# Altium project cat.PrjPcb (part 3 of 6)

## Sheet user_interface.SchDoc: User Interface
size A4; SheetNumber: 3; SheetTotal: 6
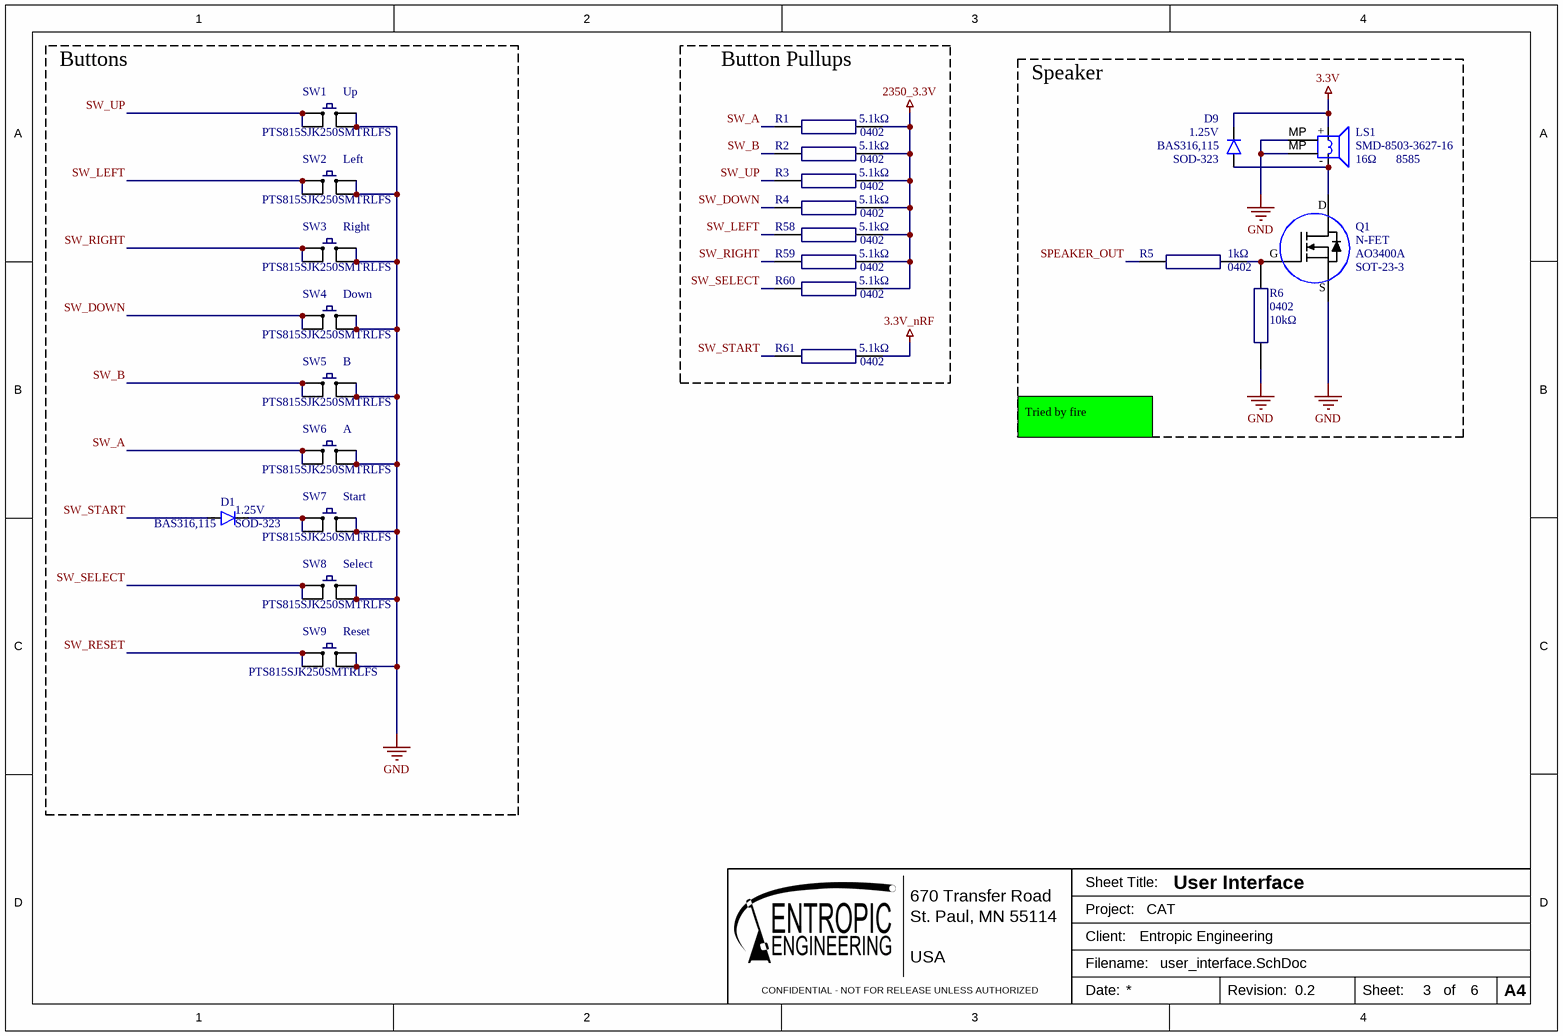
[diagram p2: user_interface.SchDoc]

### Parts
D1  Forward Voltage: 1.25V  [SOD-323]  (hidden comment: BAS316,115)
D9  Forward Voltage: 1.25V  [SOD-323]  (hidden comment: BAS316,115)
LS1  Resistance: 16Ω  package: 8585  [8585_speaker]  (hidden comment: SMD-8503-3627-16)
Q1  N-FET  Case/Package: SOT-23-3  [SOT95P280X115-3N]
R1  value 5.1kΩ  Case/Package: 0402  [0402_resistor]  (hidden comment: RC0402FR-075K1L)
R2  value 5.1kΩ  Case/Package: 0402  [0402_resistor]  (hidden comment: RC0402FR-075K1L)
R3  value 5.1kΩ  Case/Package: 0402  [0402_resistor]  (hidden comment: RC0402FR-075K1L)
R4  value 5.1kΩ  Case/Package: 0402  [0402_resistor]  (hidden comment: RC0402FR-075K1L)
R5  value 1kΩ  Case/Package: 0402  [0402_resistor]  (hidden comment: RC0402JR-071KL)
R6  value 10kΩ  Case Code (Imperial): 0402  [0402_resistor]  (hidden comment: RC0402FR-0710KL)
R58  value 5.1kΩ  Case/Package: 0402  [0402_resistor]  (hidden comment: RC0402FR-075K1L)
R59  value 5.1kΩ  Case/Package: 0402  [0402_resistor]  (hidden comment: RC0402FR-075K1L)
R60  value 5.1kΩ  Case/Package: 0402  [0402_resistor]  (hidden comment: RC0402FR-075K1L)
R61  value 5.1kΩ  Case/Package: 0402  [0402_resistor]  (hidden comment: RC0402FR-075K1L)
SW1  Up  [PTS815]
SW2  Left  [PTS815]
SW3  Right  [PTS815]
SW4  Down  [PTS815]
SW5  B  [PTS815]
SW6  A  [PTS815]
SW7  Start  [PTS815]
SW8  Select  [PTS815]
SW9  Reset  [PTS815]

### Blocks framed on the sheet
Buttons: D1 SW1-SW9
Button Pullups: R1-R4 R58-R61
Speaker: D9 LS1 Q1 R5 R6

### Nets
3.3V: D9.K LS1.+
3.3V_nRF: R61.1
2350_3.3V: R1.1 R2.1 R3.1 R4.1 R58.1 R59.1 R60.1
GND: LS1.MP Q1.2(S) R6.2 SW1.3 SW1.4 SW2.3 SW2.4 SW3.3 SW3.4 SW4.3 SW4.4 SW5.3 SW5.4 SW6.3 SW6.4 SW7.3 SW7.4 SW8.3 SW8.4 SW9.1 SW9.2
SPEAKER_OUT: R5.1
SW_A: R1.2 SW6.1 SW6.2
SW_B: R2.2 SW5.1 SW5.2
SW_DOWN: R4.2 SW4.1 SW4.2
SW_LEFT: R58.2 SW2.1 SW2.2
SW_RESET: SW9.3 SW9.4
SW_RIGHT: R59.2 SW3.1 SW3.2
SW_SELECT: R60.2 SW8.1 SW8.2
SW_START: D1.A R61.2
SW_UP: R3.2 SW1.1 SW1.2
NetD1_K: D1.K SW7.1 SW7.2
NetD9_A: D9.A LS1.- Q1.3(D)
NetQ1_1: Q1.1(G) R5.2 R6.1

### Notes on the sheet
- Tried by fire
- 670 Transfer Road
- St. Paul, MN 55114
- Sheet Title:
- Project:
- CONFIDENTIAL - NOT FOR RELEASE UNLESS AUTHORIZED
- USA
- Client:
- Filename:
- Date:
- Revision:
- Sheet:
- of
- A4

### Library data of the parts
D1 D9 = BAS316,115: 1.25 V, 100 V max, 150 mA, 4 ns diode, SOD-323; Manufacturer: Nexperia; Diode Element Material: SILICON; Package Body Material: Plastic; Diode Type: RECTIFIER; Non-rep Pk Forward Current-Max: 4A; Number of Elements: 1; Max Output current: 250mA; Max Power Dissipation: 400mW; Rep Pk Reverse Voltage-Max: 85V; Max Reverse Current: 1uA; Reverse Recovery Time-Max: 0.004us; Time @ Peak Reflow Temperature-Max (s): 40s; Reference Standard: AEC-Q101; Qualification Status: Not Qualified; Supplier 1: LCSC; Manufacturer Part Number: BAS316,115; RoHS: Yes; Category: Rectifier Diodes; Stock 1: 292660; Pricing 1: 50=0.0098, 500=0.0076, 3000=0.0067, 6000=0.0058, 24000=0.0055, 51000=0.0053 (USD); Pins: 2; Package Shape: Rectangular; Terminal Finish: Tin; Max Operating Temperature: 150°C; JESD-609 Code: e3; JESD-30 Code: R-PDSO-G2; Moisture Sensitivity Level: 1; Package Style: SMALL OUTLINEMeter; Peak Reflow Temperature (Cel): 260°C; Surface Mount: Yes; Terminal Form: Gull Wing; Terminal Position: DUAL; Reach SVHC Compliant: Yes; RoHS Compliant: Yes; ComponentLink1URL: https://datasheet.ciiva.com:443/pdfs/VipMasterIC/IC/PHGL/PHGL-S-A0000133609/PHGL-S-A0000133609-1.pdf?src-supplier=IHS+Markit; ComponentLink1Description: https://datasheet.ciiva.com:443/pdfs/VipMasterIC/IC/PHGL/PHGL-S-A0000133609/PHGL-S-A0000133609-1.pdf?src-supplier=IHS+Markit; ComponentLink2URL: http://www.farnell.com/datasheets/1856332.pdf?src-supplier=Farnell; ComponentLink2Description: http://www.farnell.com/datasheets/1856332.pdf?src-supplier=Farnell; ComponentLink3URL: https://datasheet.octopart.com/BAS316%2C115-Nexperia-datasheet-32749520.pdf?src-supplier=Element14; ComponentLink3Description: https://datasheet.octopart.com/BAS316%2C115-Nexperia-datasheet-32749520.pdf?src-supplier=Element14; ComponentLink4URL: https://datasheet.octopart.com/BAS316%2C115-Nexperia-datasheet-77871323.pdf?src-supplier=Future+Electronics; ComponentLink4Description: https://datasheet.octopart.com/BAS316%2C115-Nexperia-datasheet-77871323.pdf?src-supplier=Future+Electronics; ComponentLink5URL: https://assets.nexperia.com/documents/data-sheet/BAS16_SER.pdf?src-supplier=Digikey; ComponentLink5Description: https://assets.nexperia.com/documents/data-sheet/BAS16_SER.pdf?src-supplier=Digikey; ComponentLink6URL: http://www.farnell.com/datasheets/1856332.pdf?src-supplier=Newark; ComponentLink6Description: http://www.farnell.com/datasheets/1856332.pdf?src-supplier=Newark; ComponentLink7URL: https://datasheet.octopart.com/BAS316%2C115-NXP-datasheet-5319124.pdf?src-supplier=TME; ComponentLink7Description: https://datasheet.octopart.com/BAS316%2C115-NXP-datasheet-5319124.pdf?src-supplier=TME; Supplier Part Number 1: C109218; Package: SOD-323
LS1 = SMD-8503-3627-16: 16 Ω, 8.5 mm x 8.5 mm, SMD speaker; Manufacturer: S&S; Supplier 1: LCSC; RoHS: No; Category: Uncategorized; Stock 1: 6390; Pricing 1: 5=0.2676, 50=0.2148, 150=0.1922, 1000=0.1559, 2000=0.1433, 5000=0.1358 (USD); Supplier Part Number 1: C2685545; Manufacturer Part Number: SMD-8503-3627-16; house_part_number: SMD-8503-3627-16
Q1 = AO3400A: N-FET, 30V, 5.7A, SOT-23-3; Manufacturer: Alpha & Omega Semiconductor; Rds On Max: 26.5mR; Input Capacitance: 630pF; Max Power Dissipation: 1.4W; Drain to Source Resistance: 18mR; Number of Channels: 1NUMBER; Threshold Voltage: 650mV; Turn-Off Delay Time: 25ns; Turn-On Delay Time: 3ns; Supplier: Arrow Electronics; RoHS: Yes; Category: MOSFETs; Stock: 141000; Pricing: 3000=0.0899, 6000=0.0869, 9000=0.0763, 30000=0.0746, 75000=0.0627 (USD); Mounting Technology: Surface Mount; Min Operating Temperature: -55°C; Max Operating Temperature: 150°C; Packaging: Cut Tape; Drain to Source Voltage (Vdss): 30V; Continuous Drain Current (ID): 5.7A; Series: -; Drain to Source Breakdown Voltage: 30V; Height: 1.25mm; Lead Free: Lead Free; RoHS Compliant: Yes; ComponentLink1URL: https://datasheet.ciiva.com/940/ao3400a-940739.pdf?src-supplier=Digikey; ComponentLink1Description: https://datasheet.ciiva.com/940/ao3400a-940739.pdf?src-supplier=Digikey; ComponentLink2URL: https://datasheet.ciiva.com/26906/getdatasheetpartid-64438-26906526.pdf?src-supplier=Verical; ComponentLink2Description: https://datasheet.ciiva.com/26906/getdatasheetpartid-64438-26906526.pdf?src-supplier=Verical; ComponentLink3URL: https://datasheet.ciiva.com/940/ao3400a-940740.pdf?src-supplier=Digikey; ComponentLink3Description: https://datasheet.ciiva.com/940/ao3400a-940740.pdf?src-supplier=Digikey; ComponentLink4URL: https://datasheet.ciiva.com/940/ao3400a-940741.pdf?src-supplier=Digikey; ComponentLink4Description: https://datasheet.ciiva.com/940/ao3400a-940741.pdf?src-supplier=Digikey; Manufacturer Part Number: AO3400A; house_part_number: AO3400A; Supplier Part Number 1: AO3400A
R1-R4 R58-R61 = RC0402FR-075K1L: 5.1 kΩ, 0402 Chip resistor; Manufacturer: Yageo; house_part_number: R-5.1k-0402-1%-001; Power Rating: 63mW; Tolerance: 1%; Temperature Coefficient: 100ppm/°C; Voltage Rating: 50V; Manufacturer Part Number: RC0402FR-075K1L; RoHS: Yes; Category: Chip SMD Resistors; Stock: 1190000; Pricing: 10000=0.0024, 50000=0.0023, 250000=0.0021, 500000=0.0021, 1500000=0.0019 (USD); Case Code (Metric): 1005; Case Code (Imperial): 0402; Min Operating Temperature: -55°C; Max Operating Temperature: 155°C; Technology: THICK FILM; Packaging: Tape and Reel; Package Quantity: 1; Resistor Type: Thick Film; Number of Terminations: 2; Termination: SMD/SMT; Max Power Dissipation: 63mW; Working Voltage: 50V; Features: Moisture Resistant; Series: RC; Resistance Tolerance: 1%; Construction: Rectangular; Voltage Rating (DC): 50V; Length: 1mm; Width: 0.02inch; Height: 0.016inch; Depth: 0.5mm; RoHS Compliant: Yes; Military Standard: Not; Reach SVHC Compliant: Unknown; Lead Free: 5697LeadFree; ComponentLink1URL: https://datasheet.ciiva.com/7983/1018594-7983519.pdf?src-supplier=Element14; ComponentLink1Description: https://datasheet.ciiva.com/7983/1018594-7983519.pdf?src-supplier=Element14; ComponentLink2URL: https://datasheet.ciiva.com/46394/1018594-46394936.pdf?src-supplier=Element14; ComponentLink2Description: https://datasheet.ciiva.com/46394/1018594-46394936.pdf?src-supplier=Element14; ComponentLink3URL: https://datasheet.ciiva.com/2453/pyu-r-int-thick-7-2453401.pdf?src-supplier=Digikey; ComponentLink3Description: https://datasheet.ciiva.com/2453/pyu-r-int-thick-7-2453401.pdf?src-supplier=Digikey; ComponentLink4URL: https://datasheet.ciiva.com/2453/pyu-r-int-thick-7-2453402.pdf?src-supplier=Digikey; ComponentLink4Description: https://datasheet.ciiva.com/2453/pyu-r-int-thick-7-2453402.pdf?src-supplier=Digikey; ComponentLink5URL: https://datasheet.ciiva.com/2453/pyu-r-int-thick-7-2453400.pdf?src-supplier=Digikey; ComponentLink5Description: https://datasheet.ciiva.com/2453/pyu-r-int-thick-7-2453400.pdf?src-supplier=Digikey; ComponentLink6URL: https://datasheet.ciiva.com/12558/pyu-rc0402-51-rohs-l-6-r-8721-12558460.pdf?src-supplier=Mouser; ComponentLink6Description: https://datasheet.ciiva.com/12558/pyu-rc0402-51-rohs-l-6-r-8721-12558460.pdf?src-supplier=Mouser; ComponentLink7URL: https://datasheet.ciiva.com/16744/pyu-rc0402-51-rohs-l-6-r-16744283.pdf?src-supplier=Future+Electronics; ComponentLink7Description: https://datasheet.ciiva.com/16744/pyu-rc0402-51-rohs-l-6-r-16744283.pdf?src-supplier=Future+Electronics; ComponentLink8URL: https://datasheet.ciiva.com/15189/getdatasheetpartid-323636-15189493.pdf?src-supplier=Verical; ComponentLink8Description: https://datasheet.ciiva.com/15189/getdatasheetpartid-323636-15189493.pdf?src-supplier=Verical; Supplier 1: Future Electronics; Supplier Part Number 1: 6053649
R5 = RC0402JR-071KL: 1 kΩ, 0402 Chip resistor; Manufacturer: Yageo; house_part_number: R-1k-0402-1%-001; Tolerance: 5%; Temperature Coefficient: 100ppm/°C; Voltage Rating: 50V; Power Rating: 62.5mW; Max Power Dissipation: 63mW; Manufacturer Part Number: RC0402JR-071KL; RoHS: Yes; Category: Chip SMD Resistors; Min Operating Temperature: -55°C; Max Operating Temperature: 155°C; Resistor Type: Thick Film; Packaging: Cut Tape; Termination: SMD/SMT; RoHS Compliant: Yes; ComponentLink1URL: https://datasheet.ciiva.com/7983/1018594-7983558.pdf?src-supplier=Element14; ComponentLink1Description: https://datasheet.ciiva.com/7983/1018594-7983558.pdf?src-supplier=Element14; ComponentLink2URL: https://datasheet.ciiva.com/2452/pyu-r-int-thick-7-2452756.pdf?src-supplier=Digikey; ComponentLink2Description: https://datasheet.ciiva.com/2452/pyu-r-int-thick-7-2452756.pdf?src-supplier=Digikey; ComponentLink3URL: https://datasheet.ciiva.com/2452/pyu-r-int-thick-7-2452757.pdf?src-supplier=Digikey; ComponentLink3Description: https://datasheet.ciiva.com/2452/pyu-r-int-thick-7-2452757.pdf?src-supplier=Digikey; ComponentLink4URL: https://datasheet.ciiva.com/2452/pyu-r-int-thick-7-2452755.pdf?src-supplier=Digikey; ComponentLink4Description: https://datasheet.ciiva.com/2452/pyu-r-int-thick-7-2452755.pdf?src-supplier=Digikey; ComponentLink5URL: https://datasheet.ciiva.com/7850/1018594-7850170.pdf?src-supplier=Element14; ComponentLink5Description: https://datasheet.ciiva.com/7850/1018594-7850170.pdf?src-supplier=Element14; Stock: 15490862; Pricing: 1=0.1, 10=0.018, 50=0.0102, 100=0.0083, 500=0.00528, 1000=0.00444, 5000=0.00307 (USD); Case Code (Imperial): 0402; Case Code (Metric): 1005; Series: RC; Voltage Rating (AC): 50V; Package Quantity: 1; Number of Terminations: 2; Features: Moisture Resistant; Resistance Tolerance: 5%; Length: 0.039inch; Width: 0.02inch; Height: 0.016inch; Reach SVHC Compliant: No; Lead Free: 5697LeadFree; ComponentLink6URL: https://datasheet.ciiva.com/7850/1018594-7850171.pdf?src-supplier=Element14; ComponentLink6Description: https://datasheet.ciiva.com/7850/1018594-7850171.pdf?src-supplier=Element14; ComponentLink7URL: https://datasheet.ciiva.com/17081/pyu-rc0402-51-rohs-l-6-r-17081438.pdf?src-supplier=Future+Electronics; ComponentLink7Description: https://datasheet.ciiva.com/17081/pyu-rc0402-51-rohs-l-6-r-17081438.pdf?src-supplier=Future+Electronics; Supplier 1: Digikey; Supplier Part Number 1: 311-1.0KJRCT-ND
R6 = RC0402FR-0710KL: 10 kΩ, 0402 Chip resistor; Manufacturer: Yageo; house_part_number: R-10k-0402-1%-001; Tolerance: 1%; Power Rating: 62.5mW; Temperature Coefficient: 100ppm/°C; Max Power Dissipation: 63mW; Voltage Rating (DC): 50V; Manufacturer Part Number: RC0402FR-0710KL; RoHS: Yes; Category: Chip SMD Resistors; Case/Package: 0402; Case Code (Metric): 1005; Min Operating Temperature: -55°C; Max Operating Temperature: 155°C; Packaging: Tape and Reel; Resistor Type: Thick Film; Number of Terminations: 2; Features: Moisture Resistant; Series: RC; Construction: Rectangular; Length: 1mm; Width: 0.5mm; Depth: 0.5mm; Military Standard: Not; Lead Free: 5697LeadFree; RoHS Compliant: Yes; ComponentLink1URL: https://datasheet.ciiva.com/12667/pyu-rc0402-51-rohs-l-6-r-12667067.pdf?src-supplier=Mouser; ComponentLink1Description: https://datasheet.ciiva.com/12667/pyu-rc0402-51-rohs-l-6-r-12667067.pdf?src-supplier=Mouser; Stock: 9380606; Pricing: 1=0.1, 10=0.015, 50=0.0088, 100=0.0073, 500=0.00488, 1000=0.00417, 5000=0.00297 (USD); Pins: 2; Termination: SMD/SMT; Voltage Rating: 50V; Resistance Tolerance: 1%; Lead Pitch: 0.2mm; Reach SVHC Compliant: Unknown; Supplier 1: Digikey; Supplier Part Number 1: 311-10.0KLRCT-ND
SW1-SW9 = PTS815SJK250SMTRLFS: Surface Mount Tactile Switch, Momentary SPST-NO 50mA 12VDC, 250gf, 4.2x3.2mm; Manufacturer: ITT C&K; Mechanical Life: 50000Cycles; Throw Configuration: SPST; Illumination Type: Non-Illuminated; Switch Function: Off-Mom; Switch Travel: 0.2mm; Ratings: IP40; Contact Resistance: 100mR; Number of Positions: 2NUMBER; RoHS: Yes; Category: Tactile Switches; Min Operating Temperature: -20°C; Max Operating Temperature: 70°C; Packaging: Cut Tape; Operating Force: 250gf; ComponentLink1URL: http://datasheet.octopart.com/PTS815SJK250SMTRLFS-C%26K-Components-datasheet-130077068.pdf?src-supplier=Digikey; ComponentLink1Description: http://datasheet.octopart.com/PTS815SJK250SMTRLFS-C%26K-Components-datasheet-130077068.pdf?src-supplier=Digikey; Manufacturer Part Number: PTS815SJK250SMTRLFS; Supplier: Digikey; Supplier Part Number: CKN12216-1-ND; Stock: 20870; Pricing: 1=0.26, 10=0.209, 25=0.1928, 100=0.1701, 250=0.1564, 500=0.14674, 1000=0.13758 (USD); Mounting Technology: Surface Mount; Series: PTS815; ComponentLink2URL: http://datasheet.octopart.com/PTS815SJK250SMTRLFS-C%26K-Components-datasheet-130077068.pdf?src-supplier=Newark; ComponentLink2Description: http://datasheet.octopart.com/PTS815SJK250SMTRLFS-C%26K-Components-datasheet-130077068.pdf?src-supplier=Newark; ComponentLink3URL: http://datasheet.octopart.com/PTS815SJK250SMTRLFS-C%26K-Components-datasheet-130077068.pdf?src-supplier=Mouser; ComponentLink3Description: http://datasheet.octopart.com/PTS815SJK250SMTRLFS-C%26K-Components-datasheet-130077068.pdf?src-supplier=Mouser; ComponentLink4URL: http://datasheet.octopart.com/PTS815SJK250SMTRLFS-C%26K-Components-datasheet-130077068.pdf?src-supplier=Verical; ComponentLink4Description: http://datasheet.octopart.com/PTS815SJK250SMTRLFS-C%26K-Components-datasheet-130077068.pdf?src-supplier=Verical; ComponentLink5URL: http://datasheet.octopart.com/PTS815SJK250SMTRLFS-C%26K-Components-datasheet-130077068.pdf?src-supplier=Future+Electronics; ComponentLink5Description: http://datasheet.octopart.com/PTS815SJK250SMTRLFS-C%26K-Components-datasheet-130077068.pdf?src-supplier=Future+Electronics; ComponentLink6URL: http://datasheet.octopart.com/PTS815SJK250SMTRLFS-C%26K-Components-datasheet-130077068.pdf?src-supplier=Onlinecomponents.com; ComponentLink6Description: http://datasheet.octopart.com/PTS815SJK250SMTRLFS-C%26K-Components-datasheet-130077068.pdf?src-supplier=Onlinecomponents.com; ComponentLink7URL: http://datasheet.octopart.com/PTS815SJK250SMTRLFS-C%26K-Components-datasheet-130077068.pdf?src-supplier=Avnet; ComponentLink7Description: http://datasheet.octopart.com/PTS815SJK250SMTRLFS-C%26K-Components-datasheet-130077068.pdf?src-supplier=Avnet; ComponentLink8URL: http://datasheet.octopart.com/PTS815SJK250SMTRLFS-C%26K-Components-datasheet-130077068.pdf?src-supplier=Allied+Electronics; ComponentLink8Description: http://datasheet.octopart.com/PTS815SJK250SMTRLFS-C%26K-Components-datasheet-130077068.pdf?src-supplier=Allied+Electronics; ComponentLink9URL: http://datasheet.octopart.com/PTS815SJK250SMTRLFS-C%26K-Components-datasheet-130077068.pdf?src-supplier=Electro+Sonic; ComponentLink9Description: http://datasheet.octopart.com/PTS815SJK250SMTRLFS-C%26K-Components-datasheet-130077068.pdf?src-supplier=Electro+Sonic; ComponentLink10URL: http://datasheet.octopart.com/PTS815SJK250SMTRLFS-C%26K-Components-datasheet-130077068.pdf?src-supplier=NAC+Semi; ComponentLink10Description: http://datasheet.octopart.com/PTS815SJK250SMTRLFS-C%26K-Components-datasheet-130077068.pdf?src-supplier=NAC+Semi; ComponentLink11URL: http://datasheet.octopart.com/PTS815SJK250SMTRLFS-C%26K-Components-datasheet-130077068.pdf?src-supplier=LCSC; ComponentLink11Description: http://datasheet.octopart.com/PTS815SJK250SMTRLFS-C%26K-Components-datasheet-130077068.pdf?src-supplier=LCSC; ComponentLink12URL: http://datasheet.octopart.com/PTS815SJK250SMTRLFS-C%26K-Components-datasheet-130077068.pdf?src-supplier=TTI; ComponentLink12Description: http://datasheet.octopart.com/PTS815SJK250SMTRLFS-C%26K-Components-datasheet-130077068.pdf?src-supplier=TTI; ComponentLink13URL: http://datasheet.octopart.com/PTS815SJK250SMTRLFS-C%26K-Components-datasheet-130077068.pdf?src-supplier=Sager+Electronics; ComponentLink13Description: http://datasheet.octopart.com/PTS815SJK250SMTRLFS-C%26K-Components-datasheet-130077068.pdf?src-supplier=Sager+Electronics; ComponentLink14URL: https://datasheet.octopart.com/PTS815SJK250SMTRLFS-C%26K-Components-datasheet-166147782.pdf?src-supplier=TME; ComponentLink14Description: https://datasheet.octopart.com/PTS815SJK250SMTRLFS-C%26K-Components-datasheet-166147782.pdf?src-supplier=TME